# EAGLE schematic sasquatch_v2 (EAGLE 6.5.0)
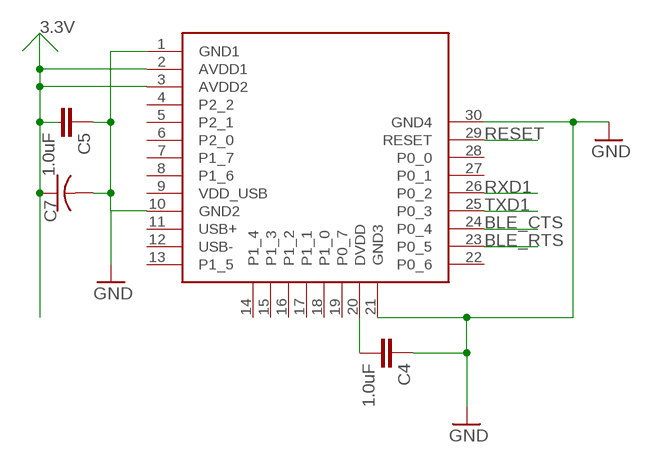
[diagram p0: schematic, sheet 1, part 1 of 2]
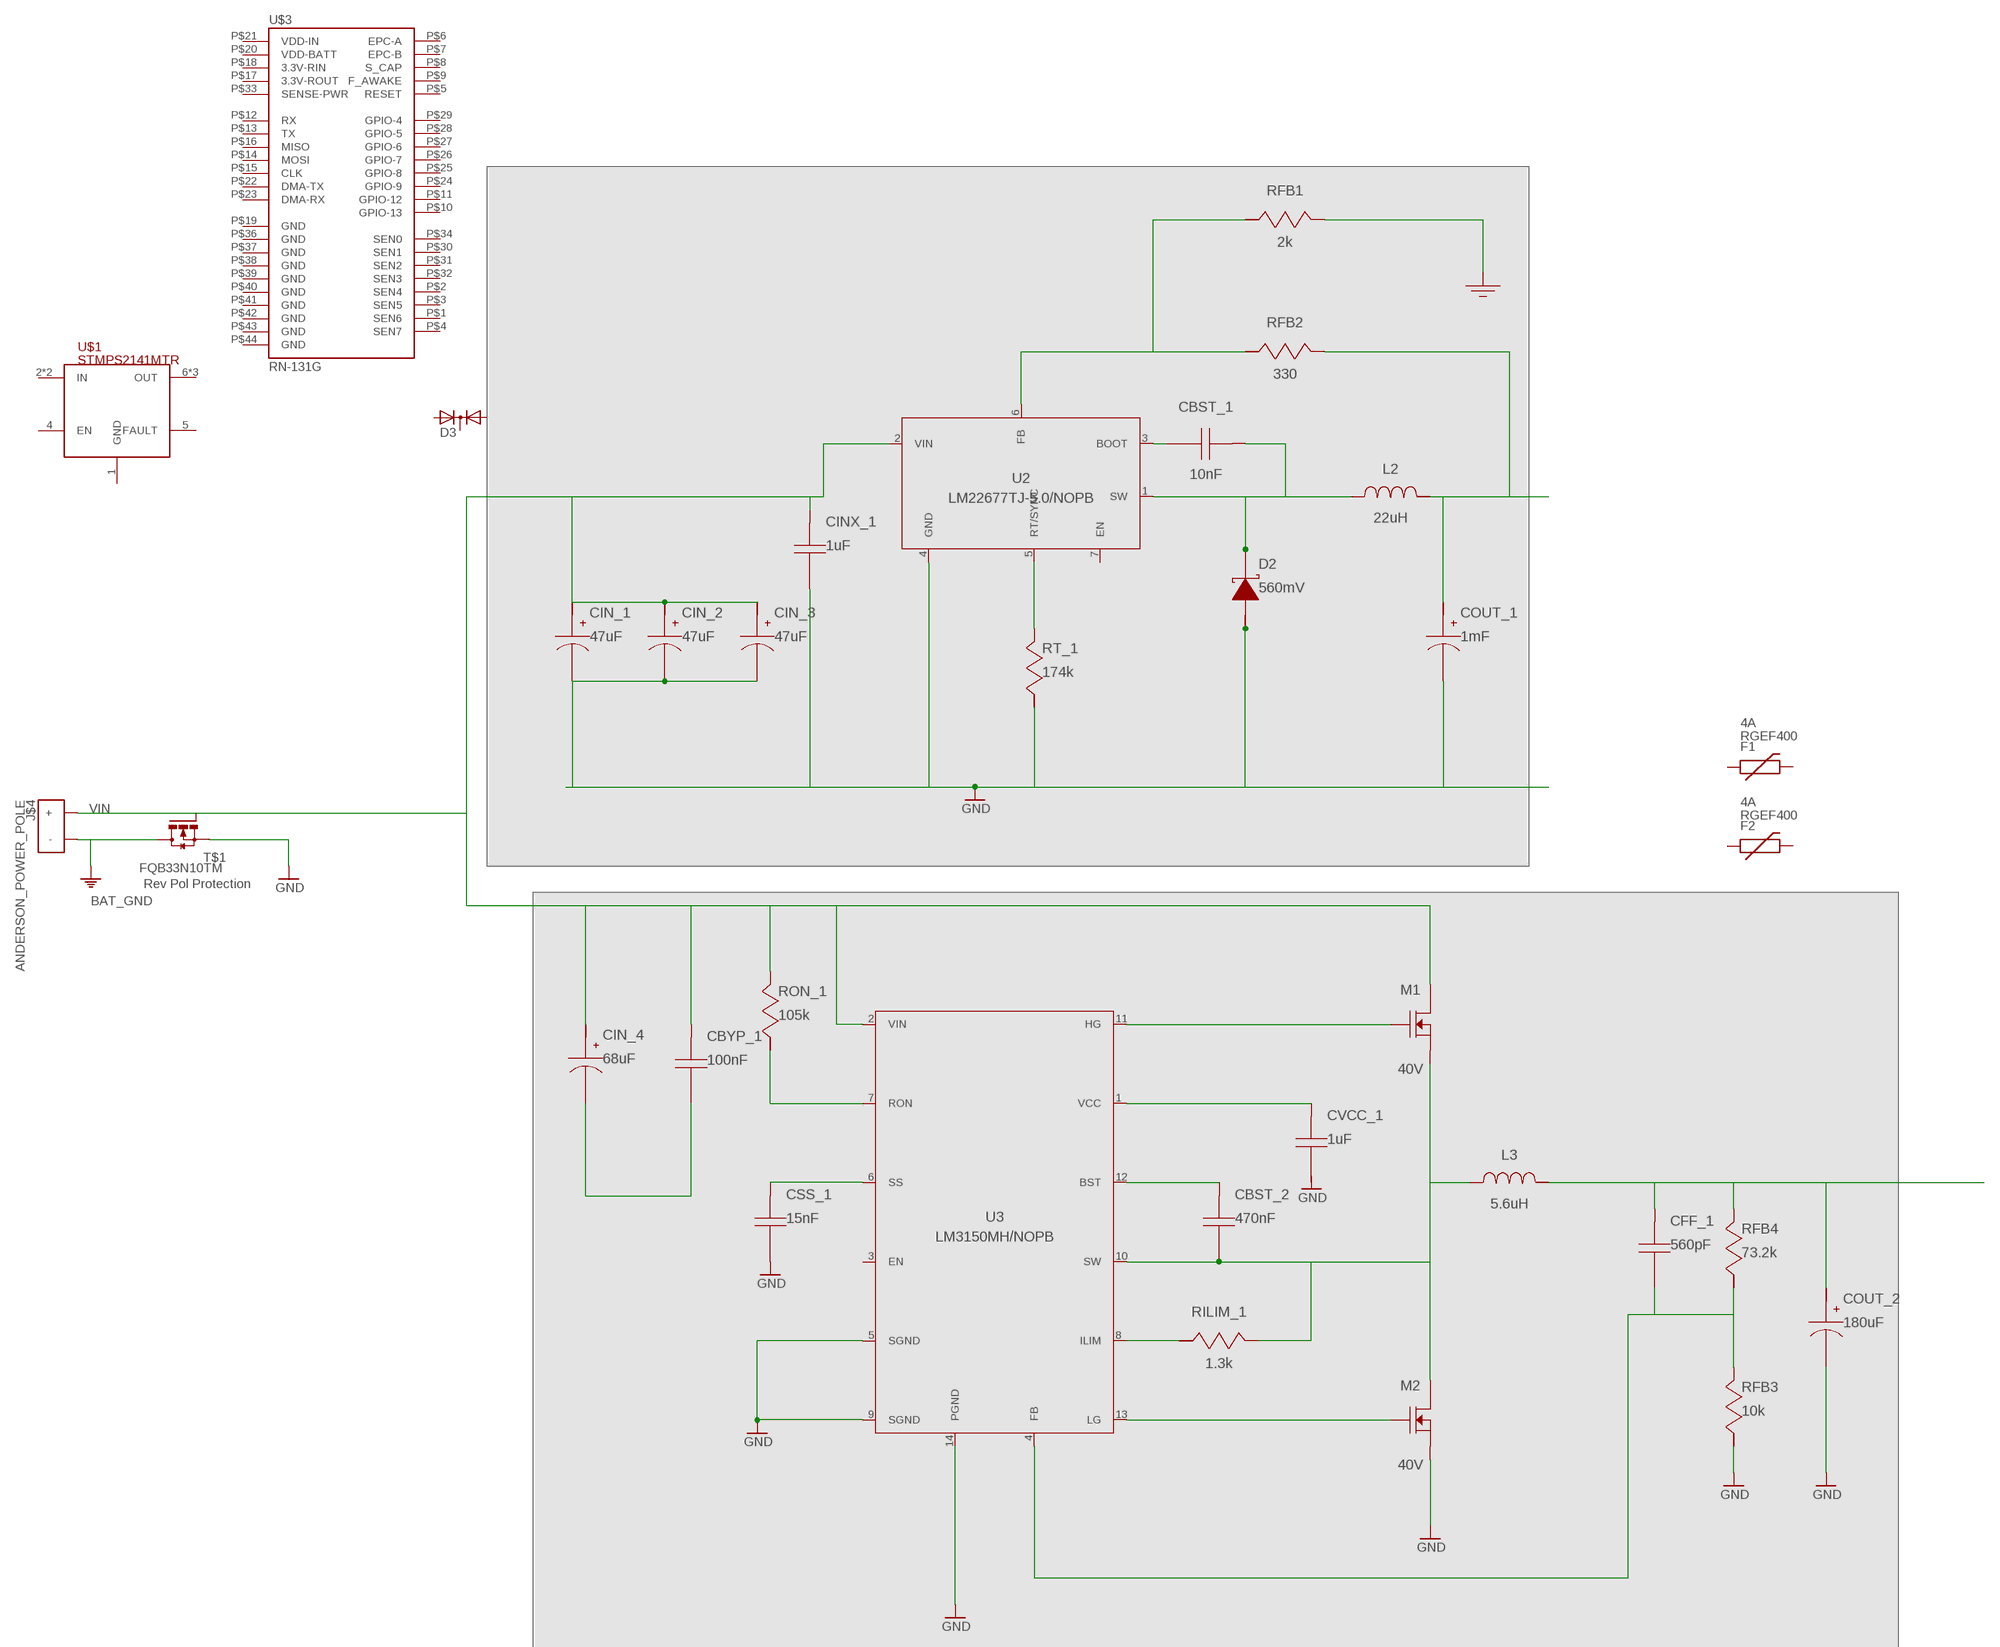
[diagram p1: schematic, sheet 1, part 2 of 2]

## Parts
C4  1.0uF  1.0UF-16V-10%(0603)  [0603-CAP]
C5  1.0uF  1.0UF-16V-10%(0603)  [0603-CAP]
C7  C-USC0603  [C0603]
CBST_1  10nF  C0805C103K5RACTUC0805C103K5RACTU  [0805]
CBST_2  470nF  EMK212B7474KD-TEMK212B7474KD-T  [0805]
CBYP_1  100nF  C0805C104K5RACTUC0805C104K5RACTU  [0805]
CFF_1  560pF  CC0805KRX7R9BB561CC0805KRX7R9BB561  [0805]
CIN_1  47uF  EEUED2D470EEUED2D470  [CAPPR5-12.5X20]
CIN_2  47uF  EEUED2D470EEUED2D470  [CAPPR5-12.5X20]
CIN_3  47uF  EEUED2D470EEUED2D470  [CAPPR5-12.5X20]
CIN_4  68uF  50SVPF68M50SVPF68M  [CAPSMT_62_F12]
CINX_1  1uF  GRM21BR71H105KA12LGRM21BR71H105KA12L  [0805]
COUT_1  1mF  UUD1A102MNL1GSUUD1A102MNL1GS  [SM_RADIAL_10BMM]
COUT_2  180uF  16SVP180M16SVP180M  [SM_RADIAL_8MM]
CSS_1  15nF  CC0805KRX7R9BB153CC0805KRX7R9BB153  [0805]
CVCC_1  1uF  EMK212B7105KG-TEMK212B7105KG-T  [0805]
D2  560mV  PDS760-13PDS760-13  [POWERDI5]
D3  DIODE-2AC|CATO220H  [TO220AB]
F1  PTCPTH  [PTC]
F2  PTCPTH  [PTC]
GND_2  WB_GND  WB_GNDWB_GND  [WB_GND]
J$4  CON-POWERPOLE  [CON-POWERPOLE]
L2  22uH  MSS1210-223MEBMSS1210-223MEB  [MSS1210]
L3  5.6uH  XAL7070-562MEBXAL7070-562MEB  [XAL7070]
M1  40V  CSD18504Q5ACSD18504Q5A  [TRANS_NEXFET_Q5A]
M2  40V  CSD18504Q5ACSD18504Q5A  [TRANS_NEXFET_Q5A]
RFB1  2k  ERJ-6ENF2001VERJ-6ENF2001V  [0805]
RFB2  330  RC0603FR-07330RLRC0603FR-07330RL  [0603]
RFB3  10k  ERJ-6ENF1002VERJ-6ENF1002V  [0805]
RFB4  73.2k  ERJ-6ENF7322VERJ-6ENF7322V  [0805]
RILIM_1  1.3k  ERJ-6ENF1301VERJ-6ENF1301V  [0805]
RON_1  105k  ERJ-6ENF1053VERJ-6ENF1053V  [0805]
RT_1  174k  ERJ-6ENF1743VERJ-6ENF1743V  [0805]
T$1  FQB33N10TM  [D2PACK]
U1  BLE112-A  [BLE112-A]
U2  LM22677TJ-5.0/NOPB  LM22677TJ-5.0/NOPBLM22677TJ-5.0/NOPB  [TJ7A]
U3  LM3150MH/NOPB  LM3150MH/NOPBLM3150MH/NOPB  [MXA14A]
U$1  STMPS2141MTR  [SOIC8]
U$3  RN-131G  [RN-131G]

## Nets
0: CIN_1.2(-) CIN_2.2(-) CIN_3.2(-) COUT_1.2(-) D2.1(A) D2.2(A) GND_2.1 RFB1.1 RT_1.2 U2.4(GND) U2.8(DAP)
1: RT_1.1 U2.5(RT/SYNC)
3: CBST_1.1 D2.3(K) L2.2 U2.1(SW)
3.3V: C5.2 C7.1 U1.2(AVDD1) U1.3(AVDD2)
4: COUT_1.1(+) RFB2.1
5: RFB1.2 RFB2.2 U2.6(FB)
6: CBST_1.2 U2.3(BOOT)
7: COUT_2.1(+) L3.1 RFB4.1
8: CFF_1.2 RFB3.1 RFB4.2 U3.4(FB)
9: CBST_2.1 U3.12(BST)
10: CBST_2.2 L3.2 M1.1(SOURCE) M1.2(SOURCE) M1.3(SOURCE) M2.5(DRAIN) M2.6(DRAIN) M2.7(DRAIN) M2.8(DRAIN) RILIM_1.1 U3.10(SW)
12: CBYP_1.2 CIN_4.2(-)
13: CSS_1.1 U3.6(SS)
14: CVCC_1.1 U3.1(VCC)
15: M1.4(GATE) U3.11(HG)
16: M2.4(GATE) U3.13(LG)
17: RILIM_1.2 U3.8(ILIM)
18: RON_1.2 U3.7(RON)
BAT_GND: J$4.+(-) T$1.2(D)
GND: C4.1 C5.1 C7.2 COUT_2.2(-) CSS_1.2 M2.1(SOURCE) M2.2(SOURCE) M2.3(SOURCE) RFB3.2 T$1.3(S) U1.1(GND1) U1.10(GND2) U1.21(GND3) U1.30(GND4) U3.5(SGND) U3.9(SGND) U3.14(PGND) U3.15(DAP)
N$1: CIN_1.1(+) CIN_2.1(+) CIN_3.1(+)
N$2: U3.2(VIN)
N$9: C4.2 U1.20(DVDD)
N$10: CINX_1.2
N$11: L2.1
N$12: CFF_1.1
RESET: U1.29(RESET)
RXD1: U1.26(P0_2)
VIN: CBYP_1.1 CIN_4.1(+) CINX_1.1 J$4.-(+) M1.5(DRAIN) M1.6(DRAIN) M1.7(DRAIN) M1.8(DRAIN) RON_1.1 T$1.1(G) U2.2(VIN)
Unconnected: CVCC_1.2 D3.A1 D3.A2 D3.C F1.P$1 F1.P$2 F2.P$1 F2.P$2 U1.4(P2_2) U1.5(P2_1) U1.6(P2_0) U1.7(P1_7) U1.8(P1_6) U1.9(VDD_USB) U1.11(USB+) U1.12(USB-) U1.13(P1_5) U1.14(P1_4) U1.15(P1_3) U1.16(P1_2) U1.17(P1_1) U1.18(P1_0) U1.19(P0_7) U1.22(P0_6) U1.23(P0_5) U1.24(P0_4) U1.25(P0_3) U1.27(P0_1) U1.28(P0_0) U2.7(EN) U3.3(EN) U$1.1(GND) U$1.2(IN) U$1.3(IN) U$1.4(EN) U$1.5(FAULT) U$1.6(OUT) U$1.7(OUT) U$1.8(OUT) U$3.P$1(SEN6) U$3.P$2(SEN4) U$3.P$3(SEN5) U$3.P$4(SEN7) U$3.P$5(RESET) U$3.P$6(EPC-A) U$3.P$7(EPC-B) U$3.P$8(S_CAP) U$3.P$9(F_AWAKE) U$3.P$10(GPIO-13) U$3.P$11(GPIO-12) U$3.P$12(RX) U$3.P$13(TX) U$3.P$14(MOSI) U$3.P$15(CLK) U$3.P$16(MISO) U$3.P$17(3.3V-ROUT) U$3.P$18(3.3V-RIN) U$3.P$19(GND) U$3.P$20(VDD-BATT) U$3.P$21(VDD-IN) U$3.P$22(DMA-TX) U$3.P$23(DMA-RX) U$3.P$24(GPIO-9) U$3.P$25(GPIO-8) U$3.P$26(GPIO-7) U$3.P$27(GPIO-6) U$3.P$28(GPIO-5) U$3.P$29(GPIO-4) U$3.P$30(SEN1) U$3.P$31(SEN2) U$3.P$32(SEN3) U$3.P$33(SENSE-PWR) U$3.P$34(SEN0) U$3.P$36(GND) U$3.P$37(GND) U$3.P$38(GND) U$3.P$39(GND) U$3.P$40(GND) U$3.P$41(GND) U$3.P$42(GND) U$3.P$43(GND) U$3.P$44(GND)

## Library data of the parts
C4 C5 = SparkFun-Capacitors:1.0UF-16V-10%(0603): CAP-00868; PROD_ID: CAP-00868
C7 = rcl:C-US: CAPACITOR, American symbol
CBST_1 = AcceleratedDesigns_Lib:C0805C103K5RACTU; CAP: 1.0E-8; ESR: 1.739; IRMS: 0.411; MANUFACTURER_NAME: Kemet; MANUFACTURER_PART_NUMBER: C0805C103K5RACTU; VDC: 50.0; VENDOR: Kemet
CBST_2 = AcceleratedDesigns_Lib:EMK212B7474KD-T; CAP: 4.7E-7; ESR: 0.0; IRMS: 0.0; MANUFACTURER_NAME: Taiyo Yuden; MANUFACTURER_PART_NUMBER: EMK212B7474KD-T; VDC: 16.0; VENDOR: Taiyo Yuden
CBYP_1 = AcceleratedDesigns_Lib:C0805C104K5RACTU; CAP: 1.0E-7; ESR: 0.064; IRMS: 1.64; MANUFACTURER_NAME: Kemet; MANUFACTURER_PART_NUMBER: C0805C104K5RACTU; VDC: 50.0; VENDOR: Kemet
CFF_1 = AcceleratedDesigns_Lib:CC0805KRX7R9BB561; CAP: 5.6E-10; ESR: 0.0; IRMS: 0.0; MANUFACTURER_NAME: Yageo America; MANUFACTURER_PART_NUMBER: CC0805KRX7R9BB561; VDC: 50.0; VENDOR: Yageo America
CIN_1-CIN_3 = AcceleratedDesigns_Lib:EEUED2D470; CAP: 4.7E-5; ESR: 0.380955; IRMS: 0.79; MANUFACTURER_NAME: Panasonic; MANUFACTURER_PART_NUMBER: EEUED2D470; VDC: 200.0; VENDOR: Panasonic
CIN_4 = AcceleratedDesigns_Lib:50SVPF68M; CAP: 6.8E-5; DATASHEET_URL: http://industrial.panasonic.com/www%2Ddata/pdf/AAB8000/AAB8000CE1.pdf; ESR: 0.02; IRMS: 4.3; MANUFACTURER_NAME: Sanyo; MANUFACTURER_PART_NUMBER: 50SVPF68M; VDC: 50.0; VENDOR: Sanyo
CINX_1 = AcceleratedDesigns_Lib:GRM21BR71H105KA12L; CAP: 1.0E-6; ESR: 0.0; IRMS: 0.0; MANUFACTURER_NAME: MuRata; MANUFACTURER_PART_NUMBER: GRM21BR71H105KA12L; VDC: 50.0; VENDOR: MuRata
COUT_1 = AcceleratedDesigns_Lib:UUD1A102MNL1GS; CAP: 0.0010; ESR: 0.09; IRMS: 0.67; MANUFACTURER_NAME: Nichicon; MANUFACTURER_PART_NUMBER: UUD1A102MNL1GS; VDC: 10.0; VENDOR: Nichicon
COUT_2 = AcceleratedDesigns_Lib:16SVP180M; CAP: 1.8E-4; ESR: 0.02; IRMS: 3.64; MANUFACTURER_NAME: Sanyo; MANUFACTURER_PART_NUMBER: 16SVP180M; VDC: 16.0; VENDOR: Sanyo
CSS_1 = AcceleratedDesigns_Lib:CC0805KRX7R9BB153; CAP: 1.5E-8; ESR: 0.0; IRMS: 0.0; MANUFACTURER_NAME: Yageo America; MANUFACTURER_PART_NUMBER: CC0805KRX7R9BB153; VDC: 50.0; VENDOR: Yageo America
CVCC_1 = AcceleratedDesigns_Lib:EMK212B7105KG-T; CAP: 1.0E-6; ESR: 0.0; IRMS: 0.0; MANUFACTURER_NAME: Taiyo Yuden; MANUFACTURER_PART_NUMBER: EMK212B7105KG-T; VDC: 16.0; VENDOR: Taiyo Yuden
D2 = AcceleratedDesigns_Lib:PDS760-13; DATASHEET_URL: http://www.diodes.com/datasheets/ds30477.pdf; IO: 7.0; MANUFACTURER_NAME: Diodes Inc.; MANUFACTURER_PART_NUMBER: PDS760-13; VENDOR: Diodes Inc.; VFATIO: 0.62; VRRM: 60.0
D3 = diode:DIODE-2AC|CA: Dual DIODE Anode-Cathode|Cathode-Anode
F1 F2 = SparkFun-PowerIC:PTC: Resettable Fuse PTC Resettable Fuse. Spark Fun Electronics SKU : COM-08357; I_HOLD: 4A; PART#: RGEF400
GND_2 = AcceleratedDesigns_Lib:WB_GND; MANUFACTURER_NAME: WB_GND; MANUFACTURER_PART_NUMBER: WB_GND; POWERPORTTYPE: POWER_GROUND; VALUE: Value
J$4 = con-powerpole:CON-POWERPOLE
L2 = AcceleratedDesigns_Lib:MSS1210-223MEB; DATASHEET_URL: http://www.coilcraft.com/pdfs/mss1210.pdf; DCR: 0.026; DESCRIPTION: Unknown; IDC: 6.7; L: 2.2E-5; MANUFACTURER: CoilCraft; MANUFACTURER_NAME: Coilcraft; MANUFACTURER_PART_NUMBER: MSS1210-223MEB; PACKAGE_DESIGNATOR: MSS1210; VENDOR: Coilcraft
L3 = AcceleratedDesigns_Lib:XAL7070-562MEB; DCR: 0.01; IDC: 11.4; L: 5.6E-6; MANUFACTURER_NAME: Coilcraft; MANUFACTURER_PART_NUMBER: XAL7070-562MEB; VENDOR: Coilcraft
M1 M2 = AcceleratedDesigns_Lib:CSD18504Q5A; DATASHEET_URL: http://www.ti.com/lit/ds/symlink/csd17306q5a.pdf; IDSMAX: 100.0; MANUFACTURER_NAME: Texas Instruments; MANUFACTURER_PART_NUMBER: CSD17306Q5A; QGTYP: 11.8; QUANTITY: 1; RDSON45: 0.0033; VDSMAX: 30.0; VENDOR: Texas Instruments
RFB1 = AcceleratedDesigns_Lib:ERJ-6ENF2001V; MANUFACTURER_NAME: Panasonic; MANUFACTURER_PART_NUMBER: ERJ-6ENF2001V; POWER: 0.125; RESISTANCE: 2000.0; TOLERANCE: 1.0; VENDOR: Panasonic
RFB2 = AcceleratedDesigns_Lib:RC0603FR-07330RL; MANUFACTURER_NAME: Yageo America; MANUFACTURER_PART_NUMBER: RC0603FR-07330RL; POWER: 0.1; RESISTANCE: 330.0; TOLERANCE: 1.0; VENDOR: Yageo America
RFB3 = AcceleratedDesigns_Lib:ERJ-6ENF1002V; MANUFACTURER_NAME: Panasonic; MANUFACTURER_PART_NUMBER: ERJ-6ENF1002V; POWER: 0.125; RESISTANCE: 10000.0; TOLERANCE: 1.0; VENDOR: Panasonic
RFB4 = AcceleratedDesigns_Lib:ERJ-6ENF7322V; MANUFACTURER_NAME: Panasonic; MANUFACTURER_PART_NUMBER: ERJ-6ENF7322V; POWER: 0.125; RESISTANCE: 73200.0; TOLERANCE: 1.0; VENDOR: Panasonic
RILIM_1 = AcceleratedDesigns_Lib:ERJ-6ENF1301V; MANUFACTURER_NAME: Panasonic; MANUFACTURER_PART_NUMBER: ERJ-6ENF1301V; POWER: 0.125; RESISTANCE: 1300.0; TOLERANCE: 1.0; VENDOR: Panasonic
RON_1 = AcceleratedDesigns_Lib:ERJ-6ENF1053V; MANUFACTURER_NAME: Panasonic; MANUFACTURER_PART_NUMBER: ERJ-6ENF1053V; POWER: 0.125; RESISTANCE: 105000.0; TOLERANCE: 1.0; VENDOR: Panasonic
RT_1 = AcceleratedDesigns_Lib:ERJ-6ENF1743V; MANUFACTURER_NAME: Panasonic; MANUFACTURER_PART_NUMBER: ERJ-6ENF1743V; POWER: 0.125; RESISTANCE: 174000.0; TOLERANCE: 1.0; VENDOR: Panasonic
T$1 = senior_design_library:FQB33N10TM; FUNCTION: Rev Pol Protection; I_MAX: 33A; MANUFACTURER: Fairchild; RDS_ON: 52mOhm; VGS: 10V; V_MAX: 100V
U1 = SparkFun-RF:BLE112-A: BlueGiga Bluetooth 4.0 module with integrated chip antenna and onboard 8051 processor and peripherals
U2 = AcceleratedDesigns_Lib:LM22677TJ-5.0/NOPB; DATASHEET_URL: http://www.ti.com/product/lm22677; FREQUENCY: 1000000.0; IMAX: 5.0; MANUFACTURER_NAME: Texas Instruments; MANUFACTURER_PART_NUMBER: LM22677TJ-5.0/NOPB; MKTG_PACKAGE: NA; NSID: LM22677TJ-ADJ/NOPB; PACKAGE: NA; VENDOR: Texas Instruments
U3 = AcceleratedDesigns_Lib:LM3150MH/NOPB; DATASHEET_URL: http://www.ti.com/product/lm3150; FREQUENCY: 1000000.0; IMAX: 12.0; MANUFACTURER_NAME: Texas Instruments; MANUFACTURER_PART_NUMBER: LM3150MH/NOPB; MKTG_PACKAGE: NA; NSID: LM3150MH/NOPB; PACKAGE: NA; VENDOR: Texas Instruments
U$1 = senior_design_library:STMPS2141MTR; PART#: STMPS2141MTR
U$3 = SparkFun-RF:RN-131G: Roving Netowrks WiFLy GSX Module